# Altium schematic sheet FT232RL.SchDoc
size A4; SheetNumber: 3; SheetTotal: 3
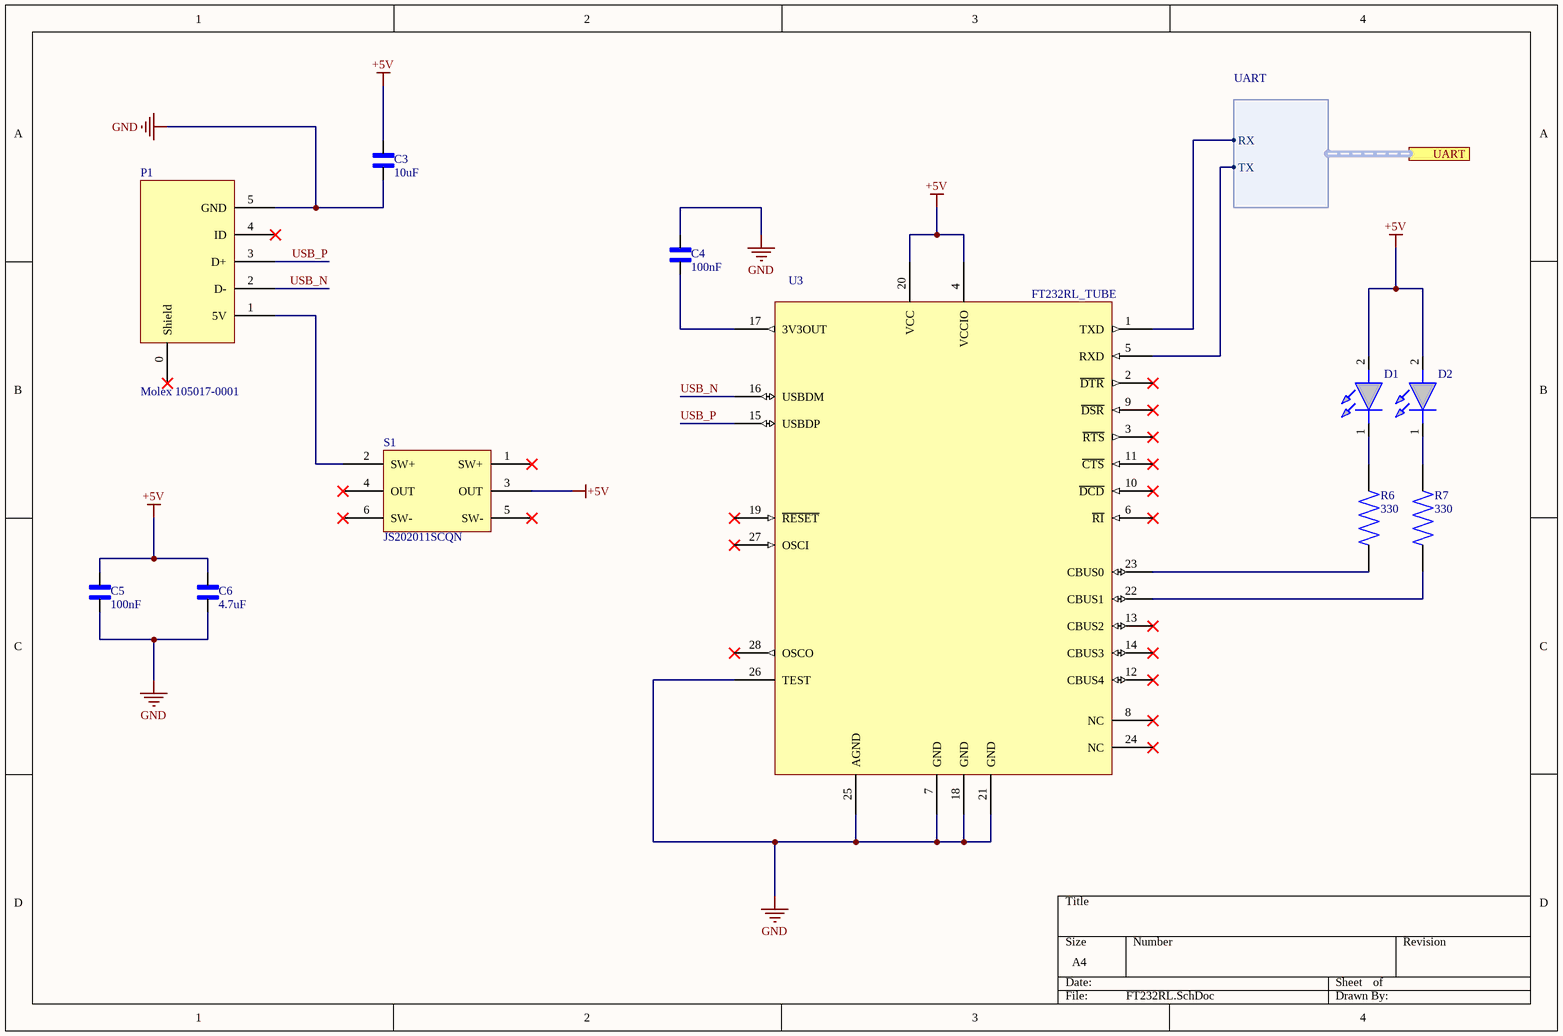
[diagram p0: FT232RL.SchDoc]

## Parts
C3  10uF  [CAPC1608X90N]
C4  100nF  [CAPC1608X90N]
C5  100nF  [CAPC1608X90N]
C6  4.7uF  [CAPC1608X90N]
D1  VLMTG1300-GS08  [LEDC1608X100N]  (value not drawn)
D2  VLMTG1300-GS08  [LEDC1608X100N]  (value not drawn)
P1  Molex 105017-0001  [Molex 105017-0001]
R6  330  [RESC1508X50N]
R7  330  [RESC1508X50N]
S1  JS202011SCQN  [SW_JS202011SCQN]
U3  FT232RL_TUBE  [FT232RL_TUBE]

## Ports
UART (harness UART, see WiFiBoard[3B], ESP8266_ESP12[2D])

## Harnesses
UART: RX, TX

## Nets
+5V: C3.2 C5.2 C6.2 D1.2(A) D2.2(A) S1.3(OUT) U3.4(VCCIO) U3.20(VCC)
GND: C3.1 C4.2 C5.1 C6.1 P1.5(GND) U3.7(GND) U3.18(GND) U3.21(GND) U3.25(AGND) U3.26(TEST)
USB_N: P1.2(D-) U3.16(USBDM)
USB_P: P1.3(D+) U3.15(USBDP)
NetC4_1: C4.1 U3.17(3V3OUT)
NetD1_1: D1.1(K) R6.2
NetD2_1: D2.1(K) R7.2
NetP1_1: P1.1(5V) S1.2(SW+)
NetR6_1: R6.1 U3.23(CBUS0)
NetR7_1: R7.1 U3.22(CBUS1)
NetU3_1: U3.1(TXD) ; port UART.RX
NetU3_5: U3.5(RXD) ; port UART.TX

Not connected (* = marked no-connect by the designer): P1 0(Shield)* 4(ID)*; S1 1(SW+)* 4(OUT)* 5(SW-)* 6(SW-)*; U3 2(~{DTR})* 3(~{RTS})* 6(~{RI})* 8(NC)* 9(~{DSR})* 10(~{DCD})* 11(~{CTS})* 12(CBUS4)* 13(CBUS2)* 14(CBUS3)* 19(~{RESET})* 24(NC)* 27(OSCI)* 28(OSCO)*

## Library data of the parts
C3-C6 = GRM188R71C104KA01D: MF: {'manufacturer': u'Murata'}; Package: None; Price: None; Value: *; MP: GRM188R71C104KA01D; Availability: Unavailable
D1 D2 = VLMTG1300-GS08: Vishay VLMTG1300-GS08, 525 nm Green LED, 1608 (0603) SMD package; Geometry.Height: 1mm; Future Part Number: *; Future Price/Stock: *; Manufacturer_Name: Vishay; Manufacturer_Part_Number: VLMTG1300-GS08; Datasheet Link: https://www.vishay.com/docs/82437/vlmo1300.pdf
P1 = Molex 105017-0001: CONN RCPT MICRO USB R/A SMD
R6 R7 = CRCW06032K20FKEA: MF: {'manufacturer': u'Vishay Dale'}; Package: None; Price: None; Value: *; MP: CRCW06032K20FKEA; Availability: Unavailable
S1 = SW_JS202011SCQN: JS Series DPDT On-On Gull Wing Surface Mount Subminiature Slide Switch
U3 = FT232RL_TUBE: FT232RL-Tube / USB UART Asynchronous Serial Data Transfer Chip, 28-pin SSOP, Tube